# Altium schematic sheet Sheet1.SchDoc
size A4; Organization: Altium Limited; Address1: L3, 12a Rodborough Rd; Address2: Frenchs Forest; Address3: NSW; Address4: Australia 2086
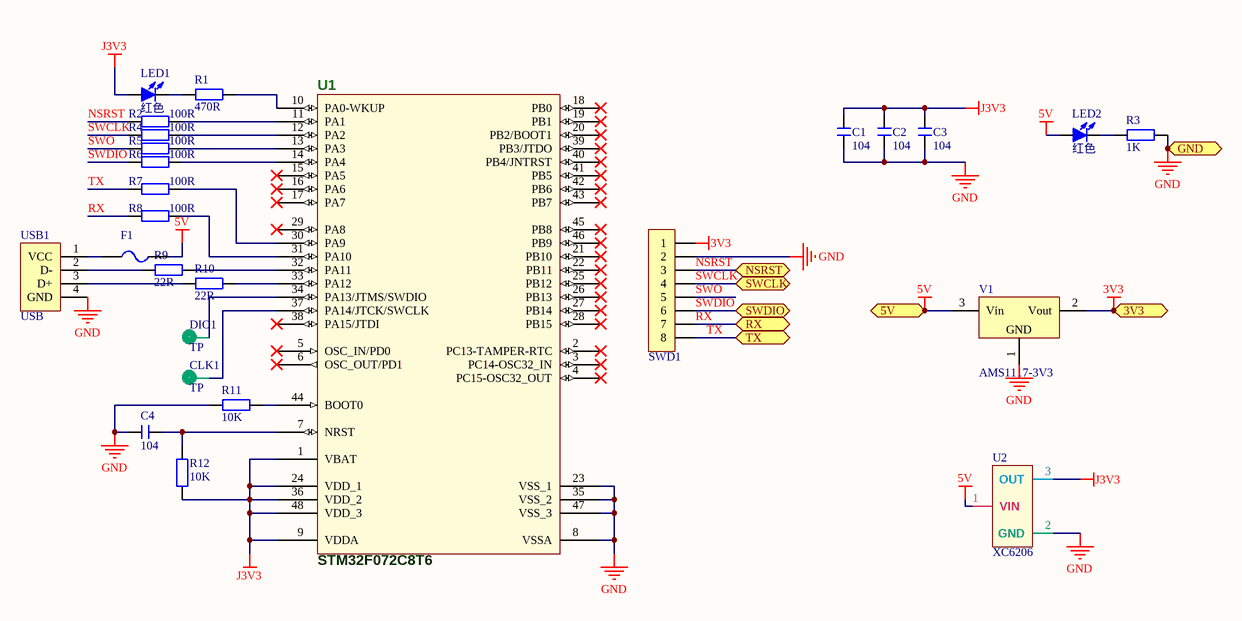
[diagram p0: Sheet1.SchDoc]

## Parts
C1  104  [C 0805]
C2  104  [C 0805]
C3  104  [C 0805]
C4  104  [C 0805]
CLK1  TP  [TP]
DIO1  TP  [TP]
F1  (no value)  [FU 0805]
LED1  红色  [LED 0805G]
LED2  红色  [LED 0805R]
R1  470R  [R 0805-HP]
R2  100R  [R 0805-HP]
R3  1K  [R 0805-HP]
R4  100R  [R 0805-HP]
R5  100R  [R 0805-HP]
R6  100R  [R 0805-HP]
R7  100R  [R 0805-HP]
R8  100R  [R 0805-HP]
R9  22R  [R 0805-HP]
R10  22R  [R 0805-HP]
R11  10K  [R 0805-HP]
R12  10K  [R 0805-HP]
SWD1  HDR-1X8  [HDR-1X8]  (value not drawn)
U1  STM32F072C8T6  [LQFP48P]
U2  XC6206  [XC6206]
USB1  USB  [USB-B/S_A]
V1  AMS1117-3V3  [SOT223_L]

## Ports
3V3, 5V, GND, NSRST, RX, SWCLK, SWDIO, TX

## Nets
3V3: SWD1.1 V1.2(Vout) ; port 3V3
5V: F1.2 LED2.1(A) U2.1(VIN) V1.3(Vin) ; port 5V
GND: C1.1 C2.1 C3.1 C4.1 R3.2 R11.1 SWD1.2 U1.8(VSSA) U1.23(VSS_1) U1.35(VSS_2) U1.47(VSS_3) U2.2(GND) USB1.4(GND) V1.1(GND) ; port GND
J3V3: C1.2 C2.2 C3.2 LED1.1(A) R12.1 U1.1(VBAT) U1.9(VDDA) U1.24(VDD_1) U1.36(VDD_2) U1.48(VDD_3) U2.3(OUT)
NSRST: R2.1 SWD1.3 ; port NSRST
RX: R8.1 SWD1.7 ; port RX
SWCLK: R4.1 SWD1.4 ; port SWCLK
SWDIO: R6.1 SWD1.6 ; port SWDIO
SWO: R5.1 SWD1.5
TX: R7.1 SWD1.8 ; port TX
NetC4_2: C4.2 R12.2 U1.7(NRST)
NetCLK1_1: CLK1.1 U1.37(PA14/JTCK/SWCLK)
NetDIO1_1: DIO1.1 U1.34(PA13/JTMS/SWDIO)
NetF1_1: F1.1 USB1.1(VCC)
NetLED1_2: LED1.2(K) R1.1
NetLED2_2: LED2.2(K) R3.1
NetR1_2: R1.2 U1.10(PA0-WKUP)
NetR2_2: R2.2 U1.11(PA1)
NetR4_2: R4.2 U1.12(PA2)
NetR5_2: R5.2 U1.13(PA3)
NetR6_2: R6.2 U1.14(PA4)
NetR7_2: R7.2 U1.30(PA9)
NetR8_2: R8.2 U1.31(PA10)
NetR9_1: R9.1 USB1.2(D-)
NetR9_2: R9.2 U1.32(PA11)
NetR10_1: R10.1 USB1.3(D+)
NetR10_2: R10.2 U1.33(PA12)
NetR11_2: R11.2 U1.44(BOOT0)

Not connected (* = marked no-connect by the designer): U1 2(PC13-TAMPER-RTC)* 3(PC14-OSC32_IN)* 4(PC15-OSC32_OUT)* 5(OSC_IN/PD0)* 6(OSC_OUT/PD1)* 15(PA5)* 16(PA6)* 17(PA7)* 18(PB0)* 19(PB1)* 20(PB2/BOOT1)* 21(PB10)* 22(PB11)* 25(PB12)* 26(PB13)* 27(PB14)* 28(PB15)* 29(PA8)* 38(PA15/JTDI)* 39(PB3/JTDO)* 40(PB4/JNTRST)* 41(PB5)* 42(PB6)* 43(PB7)* 45(PB8)* 46(PB9)*

## Notes on the sheet
- Title
- Size:
- Date:
- A4
- Number:
- Time:
- Revision:
- Sheet
- of
- File:

## Library data of the parts
C1-C4 = C: 无极性贴片电容; 版权归属: 黎明电子style; BOM名称: 无极性贴片电容; 学习资源: https://lmdzstyle.taobao.com/
F1 = FU: 贴片保险丝; 版权归属: 黎明电子style; BOM名称: 贴片保险丝; 学习资源: https://lmdzstyle.taobao.com/
LED1 LED2 = LED-SH-5MM: 5mm草帽LED; 版权归属: 黎明电子style; BOM名称: 5mm草帽LED; 学习资源: https://lmdzstyle.taobao.com/
R1-R12 = R: 贴片电阻; 版权归属: 黎明电子style; BOM名称: 贴片电阻; 学习资源: https://lmdzstyle.taobao.com/
SWD1 = Header 8: 8P接插件; 版权归属: 黎明电子style; BOM名称: 8P接插件; 学习资源: https://lmdzstyle.taobao.com/
USB1 = USB-B/S: USB-B型母接口; 版权归属: 黎明电子style; BOM名称: USB-B型母接口; 学习资源: https://lmdzstyle.taobao.com/
V1 = AMS1117: 三端稳压芯片; BOM名称: 稳压芯片; 版权归属: 黎明电子style; 学习资源: https://lmdzstyle.taobao.com/